# Altium schematic sheet MAX8510EXK18+T.SchDoc
size A; SheetNumber: 1; SheetTotal: 1
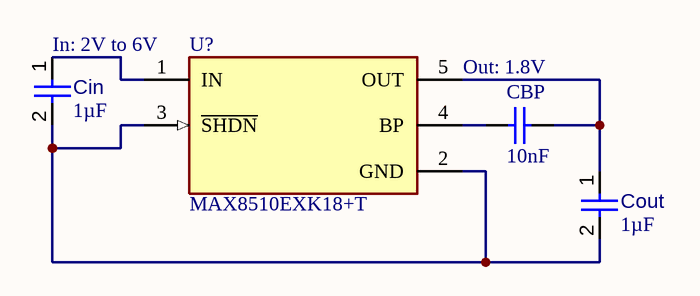
[diagram p0: MAX8510EXK18+T.SchDoc]

## Parts
CBP  10nF  [CAPC1608X92X38LL15T08]
Cin  value 1µF  [CAPC1608X94X35NL15T15]  (hidden comment: Capacitor 1 uF +/- 10% 16 V 0603)
Cout  value 1µF  [CAPC1608X94X35NL15T15]  (hidden comment: Capacitor 1 uF +/- 10% 16 V 0603)
U?  MAX8510EXK18+T  [FP-X5-1-MFG]

## Nets
NetCBP_1: CBP.1 U?.4(BP)
NetCBP_2: CBP.2 Cout.1 U?.5(OUT)
NetCin_1: Cin.1 U?.1(IN)
NetCin_2: Cin.2 Cout.2 U?.2(GND) U?.3(~{SHDN})

## Notes on the sheet
- In: 2V to 6V
- Out: 1.8V

## Library data of the parts
CBP = CMP-2006-01201-1: Manufacturer: Vitramon; Part Number: VJ0603Y103JXXAC
Cin Cout = CMP-001-00003-6: Chip Capacitor, 1 uF, +/- 10%, 16 V, 0603 (1608 Metric); Voltage Rating: 16V; Capacitor Type: Ceramic; Max Operating Temperature: 125°C; Pins: 2; Tolerance: 10%; Min Operating Temperature: -55°C; RoHS Compliant: True; Mounting Technology: SM; Case/Package: 0603
U? = CMP-0246-00401-2: IC REG LINEAR 1.8V 120MA SC70-5; Accuracy: 2%; Number of Outputs: 1; Min Current Limit: 130mA; Max Input Voltage: 6V; Max Power Dissipation: 247mW; Output Configuration: Positive; Output Type: Fixed; Quiescent Current: 90uA; Reference Voltage: 1.225V; Min Input Voltage: 2V; Power Supply Rejection Ratio (PSRR): 54dB; Input Bias Current: 40uA; Output Current: 120mA; Nominal Output Voltage: 1.8V; Output Voltage: 1.8V; Series: -; Number of Regulators: 1; Packaging: Tape and Reel; Mount: Surface Mount; Case/Package: SC; Lead Free: Lead Free; RoHS Compliant: Yes; Number of Pins: 5; Package Quantity: 2500; Max Output Current: 120mA; Polarity: Positive; Min Operating Temperature: -40°C; Max Operating Temperature: 85°C